# Altium schematic sheet USBtoUART.SchDoc
size A4; SheetNumber: 9; SheetTotal: 13
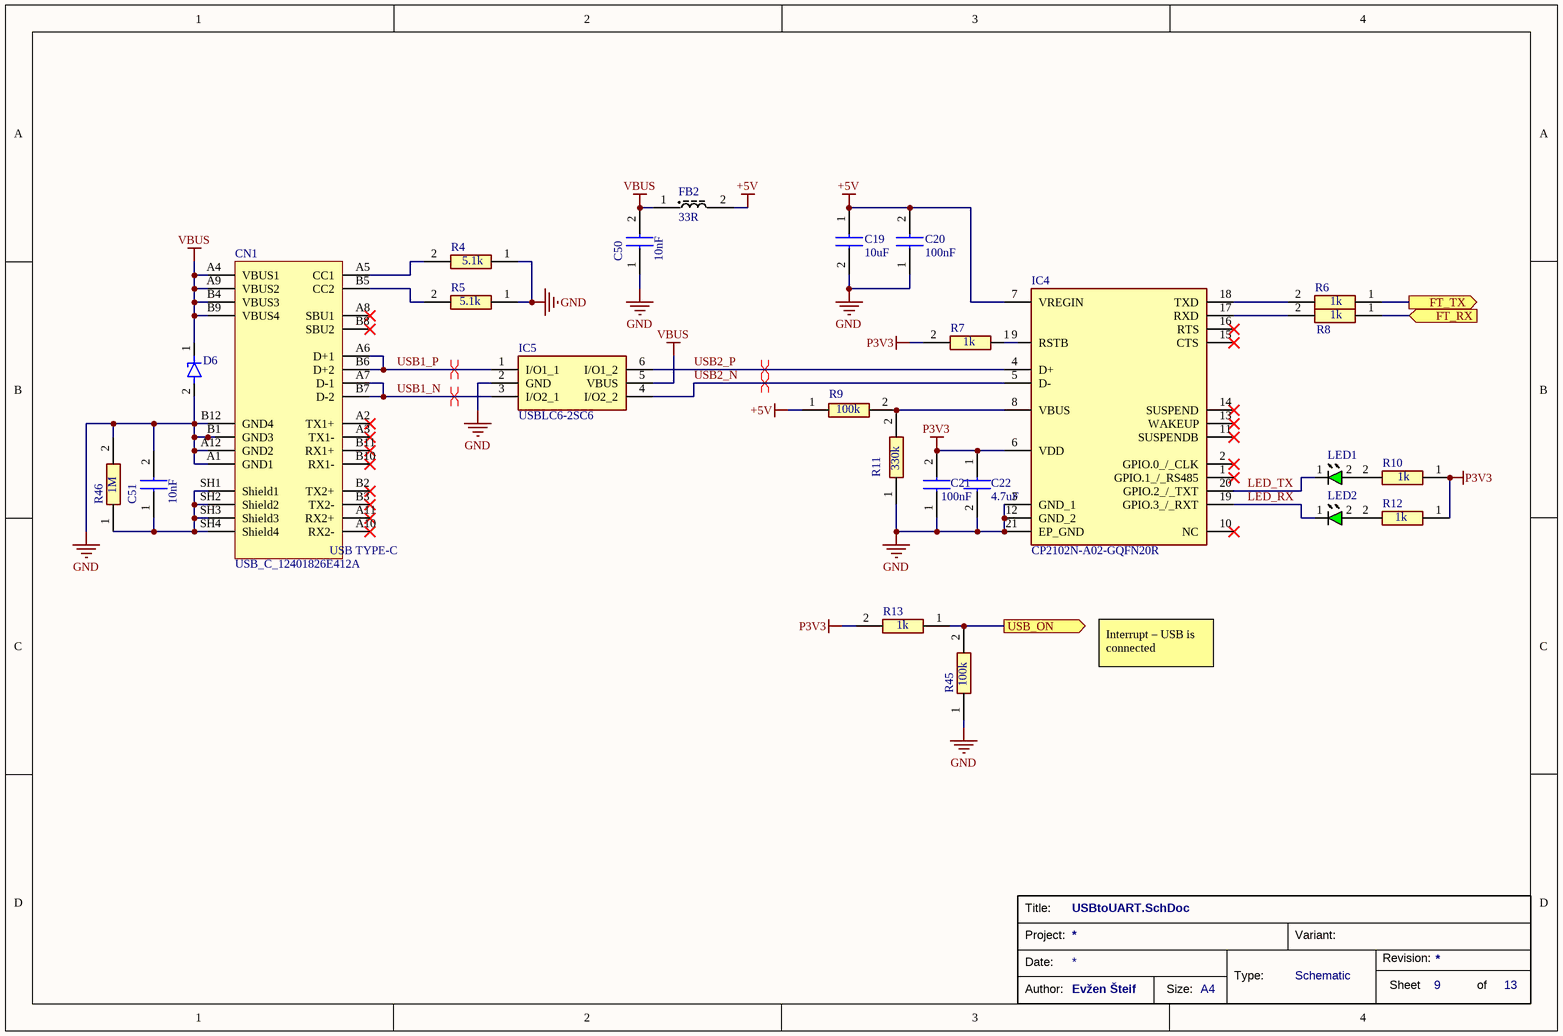
[diagram p0: USBtoUART.SchDoc]

## Parts
C19  10uF  [GRM18x]
C20  100nF  [CAPC1005X70N]
C21  100nF  [CAPC1005X70N]
C22  4.7uF  [CAPC1608X90N]
C50  10nF  [GRM15x]
C51  10nF  [GRM15x]
CN1  value USB_C_12401826E412A  [CON_USB-TYPEC_AMPHENOL_12401826E412A]  (hidden comment: USB_TYPE_C_Receptacle)
D6  ESDA25P35-1U1M  [ESDA25P351U1M]  (value not drawn)
FB2  33R  [BLM18SP221SN1B]
IC4  CP2102N-A02-GQFN20R  [CP2102NA02GQFN20]
IC5  USBLC6-2SC6  [SOT95P280X145-6N]
LED1  150060GS75000  [LEDC1608X80N]  (value not drawn)
LED2  150060GS75000  [LEDC1608X80N]  (value not drawn)
R4  5.1k  [RESC1005X35N]
R5  5.1k  [RESC1005X35N]
R6  1k  [RESC1005X35N]
R7  1k  [RESC1005X35N]
R8  1k  [RESC1005X35N]
R9  100k  [RESC1005X40N]
R10  1k  [RESC1005X35N]
R11  330k  [RESC1005X40N]
R12  1k  [RESC1005X35N]
R13  1k  [RESC1005X35N]
R45  100k  [RESC1005X40N]
R46  1M  [RESC1005X40N]

## Ports
FT_RX (in, see main[3C]), FT_TX (out, see main[3C]), USB_ON (out, see main[3C], MCU[1B])

## Nets
+5V: C19.1 C20.2 FB2.2 IC4.7(VREGIN) R9.1
GND: C19.2 C20.1 C21.1 C22.2 C50.1 C51.2 CN1.A1(GND1) CN1.A12(GND2) CN1.B1(GND3) CN1.B12(GND4) D6.2(A) IC4.3(GND_1) IC4.12(GND_2) IC4.21(EP_GND) IC5.2(GND) R4.1 R5.1 R11.1 R45.1 R46.2
P3V3: C21.2 C22.1 IC4.6(VDD) R7.2 R10.1 R12.1 R13.2
VBUS: C50.2 CN1.A4(VBUS1) CN1.A9(VBUS2) CN1.B4(VBUS3) CN1.B9(VBUS4) D6.1(K) FB2.1 IC5.5(VBUS)
FT_RX: R8.1 ; port FT_RX
FT_TX: R6.1 ; port FT_TX
LED_RX: IC4.19(GPIO.3_/_RXT) LED2.1(K)
LED_TX: IC4.20(GPIO.2_/_TXT) LED1.1(K)
USB1_N: CN1.A7(D-1) CN1.B7(D-2) IC5.3(I/O2_1)
USB1_P: CN1.A6(D+1) CN1.B6(D+2) IC5.1(I/O1_1)
USB2_N: IC4.5(D-) IC5.4(I/O2_2)
USB2_P: IC4.4(D+) IC5.6(I/O1_2)
USB_ON: R13.1 R45.2 ; port USB_ON
NetC51_1: C51.1 CN1.SH1(Shield1) CN1.SH2(Shield2) CN1.SH3(Shield3) CN1.SH4(Shield4) R46.1
NetCN1_A5: CN1.A5(CC1) R4.2
NetCN1_B5: CN1.B5(CC2) R5.2
NetIC4_8: IC4.8(VBUS) R9.2 R11.2
NetIC4_9: IC4.9(RSTB) R7.1
NetIC4_17: IC4.17(RXD) R8.2
NetIC4_18: IC4.18(TXD) R6.2
NetLED1_2: LED1.2(A) R10.2
NetLED2_2: LED2.2(A) R12.2

Not connected (* = marked no-connect by the designer): CN1 A2(TX1+)* A3(TX1-)* A8(SBU1)* A10(RX2-)* A11(RX2+)* B2(TX2+)* B3(TX2-)* B8(SBU2)* B10(RX1-)* B11(RX1+)*; IC4 1(GPIO.1_/_RS485)* 2(GPIO.0_/_CLK)* 10(NC)* 11(SUSPENDB)* 13(WAKEUP)* 14(SUSPEND)* 15(CTS)* 16(RTS)*

## Layout directives
differential pair; differential pair class USB; net class USB: USB1_N, USB1_P, USB2_N, USB2_P

## Notes on the sheet
- Interrupt – USB is connected
- Title:
- Date:
- Project:
- Type:
- Schematic
- Variant:
- Revision:
- Sheet
- of
- Author:
- Evžen Šteif
- Size:
- A4
- (in symbol MCD-03232) USB TYPE-C

## Library data of the parts
C19 = GRM188R61E106KA73D: Capacitor; Manufacturer_Name: Murata Electronics; Datasheet Link: https://search.murata.co.jp/Ceramy/image/img/A01X/G101/ENG/GRM188R61E106KA73-01A.pdf; Height: 0.9mm; Manufacturer_Part_Number: GRM188R61E106KA73D; Mouser Part Number: 81-GRM188R61E106KA3D; Mouser Price/Stock: https://www.mouser.co.uk/ProductDetail/Murata-Electronics/GRM188R61E106KA73D?qs=5aG0NVq1C4z8ebxPkQZf9A%3D%3D; Arrow Part Number: GRM188R61E106KA73D; Arrow Price/Stock: https://www.arrow.com/en/products/grm188r61e106ka73d/murata-manufacturing?region=nac
C20 C21 = GRM155R61A104KA01D: Capacitor; Manufacturer_Name: Murata Electronics; Datasheet Link: https://search.murata.co.jp/Ceramy/image/img/A01X/G101/ENG/GRM155R61A104KA01-02A.pdf; Height: 0.7mm; Manufacturer_Part_Number: GRM155R61A104KA01D; Mouser Part Number: 81-GRM155R61A104KA01; Mouser Price/Stock: https://www.mouser.co.uk/ProductDetail/Murata-Electronics/GRM155R61A104KA01D?qs=5bAuhL3RhmNZw0v59AqOJA%3D%3D; Arrow Part Number: GRM155R61A104KA01D; Arrow Price/Stock: https://www.arrow.com/en/products/grm155r61a104ka01d/murata-manufacturing?utm_currency=USD&region=europe
C22 = GRM188R61E475KE11J: Capacitor; Manufacturer_Name: Murata Electronics; Datasheet Link: https://search.murata.co.jp/Ceramy/image/img/A01X/G101/ENG/GRM188R61E475KE11-01A.pdf; Height: 0.9mm; Manufacturer_Part_Number: GRM188R61E475KE11J; Mouser Part Number: 81-GRM188R61E475KE1J; Mouser Price/Stock: https://www.mouser.co.uk/ProductDetail/Murata-Electronics/GRM188R61E475KE11J?qs=hNud%2FORuBR3%2Fa9GLJFT8KA%3D%3D; Arrow Part Number: GRM188R61E475KE11J; Arrow Price/Stock: https://www.arrow.com/en/products/grm188r61e475ke11j/murata-manufacturing
C50 C51 = GRM155R71H103KA88D: Capacitor; Manufacturer_Name: Murata Electronics; Datasheet Link: https://search.murata.co.jp/Ceramy/image/img/A01X/G101/ENG/GRM155R71H103KA88-01A.pdf; Height: 0.33mm; Manufacturer_Part_Number: GRM155R71H103KA88D; Mouser Part Number: 81-GRM155R71H103KA8D; Mouser Price/Stock: https://www.mouser.co.uk/ProductDetail/Murata-Electronics/GRM155R71H103KA88D?qs=Dfh4SrgScWxOVlCuzd3ZyQ%3D%3D; Arrow Part Number: GRM155R71H103KA88D; Arrow Price/Stock: https://www.arrow.com/en/products/grm155r71h103ka88d/murata-manufacturing?utm_currency=USD&region=nac
CN1 = MCD-03232: USB_TypeC, 24 pins, RA, SMD, T=2.96mm (USB Certified 3.1); Part_Type: Connector; Part_Preference: Recommended; Manufacturer: AMPHENOL ICC; Manufacturer_Part_Number: 12401826E412A; Component_Country_Of_Origin: China°; ShowFields: YES; ID: 5348; Internal_Part_Number: MCD-03232; Status: Checked; ComponentLink1URL: http://tunmcdsvn.tun.st.com/Component_Documentation_Library/Trunk/Connector/AMPHEMOL_ICC_12401826E412A; Order_Code_Digikey: 12401826E412ATR-ND; Order_Code_Farnell: 3727763; Order_Code_RS: N/A
D6 = ESDA25P35-1U1M: TVS Diode (Uni-directional); Manufacturer_Name: STMicroelectronics; Datasheet Link: https://www.st.com/resource/en/datasheet/esda25p35-1u1m.pdf; Height: 0.6mm; Manufacturer_Part_Number: ESDA25P35-1U1M; Mouser Part Number: 511-ESDA25P35-1U1M; Mouser Price/Stock: https://www.mouser.co.uk/ProductDetail/STMicroelectronics/ESDA25P35-1U1M?qs=aVyJF2WnouQUWqgNP85ZrA%3D%3D; Arrow Part Number: ESDA25P35-1U1M; Arrow Price/Stock: https://www.arrow.com/en/products/esda25p35-1u1m/stmicroelectronics?utm_currency=USD&region=europe
FB2 = BLM18SG330SN1D: Ferrite Bead; Manufacturer_Name: Murata Electronics; Datasheet Link: http://www.murata.com/~/media/webrenewal/support/library/catalog/products/emc/emifil/c31e.ashx?la=en-gb; Height: 0.95mm; Manufacturer_Part_Number: BLM18SG330SN1D; Mouser Part Number: 81-BLM18SG330SN1D; Mouser Price/Stock: https://www.mouser.co.uk/ProductDetail/Murata-Electronics/BLM18SG330SN1D?qs=7EBvPakHacUT88safgvlfQ%3D%3D; Arrow Part Number: BLM18SG330SN1D; Arrow Price/Stock: https://www.arrow.com/en/products/blm18sg330sn1d/murata-manufacturing
IC4 = CP2102N-A02-GQFN20R: Integrated Circuit; Manufacturer_Name: Silicon Labs; Datasheet Link: https://www.silabs.com/documents/public/data-sheets/cp2102n-datasheet.pdf; Height: 0.8mm; Manufacturer_Part_Number: CP2102N-A02-GQFN20R; Mouser Part Number: 634-CP2102NA02QFN20R; Mouser Price/Stock: https://www.mouser.co.uk/ProductDetail/Silicon-Labs/CP2102N-A02-GQFN20R?qs=u16ybLDytRbf2uwPkMBdUg%3D%3D; Arrow Part Number: CP2102N-A02-GQFN20R; Arrow Price/Stock: https://www.arrow.com/en/products/cp2102n-a02-gqfn20r/silicon-labs?utm_currency=USD&region=nac
IC5 = USBLC6-2SC6: Integrated Circuit; Manufacturer_Name: STMicroelectronics; Datasheet Link: http://www.st.com/st-web-ui/static/active/en/resource/technical/document/datasheet/CD00050750.pdf; Height: 1.45mm; Manufacturer_Part_Number: USBLC6-2SC6; Mouser Part Number: 511-USBLC6-2SC6; Mouser Price/Stock: https://www.mouser.co.uk/ProductDetail/STMicroelectronics/USBLC6-2SC6?qs=po45yt2pPpu%2FhNIlwQdTlg%3D%3D; Arrow Part Number: USBLC6-2SC6; Arrow Price/Stock: https://www.arrow.com/en/products/usblc6-2sc6/stmicroelectronics?utm_currency=USD&region=europe
LED1 LED2 = 150060GS75000: LED; Manufacturer_Name: Wurth Elektronik; Datasheet Link: https://componentsearchengine.com/Datasheets/2/150060GS75000.pdf; Height: 0.8mm; Manufacturer_Part_Number: 150060GS75000; Mouser Part Number: 710-150060GS75000; Mouser Price/Stock: https://www.mouser.co.uk/ProductDetail/Wurth-Elektronik/150060GS75000?qs=LlUlMxKIyB0UYkq5lDO8nA%3D%3D
R4 R5 = RT0402FRE075K1L: Resistor; Manufacturer_Name: YAGEO; Datasheet Link: https://www.yageo.com/upload/media/product/app/datasheet/rchip/pyu-rt_1-to-0.01_rohs_l.pdf; Height: 0.35mm; Manufacturer_Part_Number: RT0402FRE075K1L; Mouser Part Number: RT0402FRE075K1L; Mouser Price/Stock: https://www.mouser.co.uk/ProductDetail/YAGEO/RT0402FRE07100RL?qs=BXCcY9r%252B08AcvLZjF7vcwQ%3D%3D
R6-R8 R10 R12 R13 = RT0402FRE071KL: Resistor; Manufacturer_Name: KEMET; Datasheet Link: https://www.yageo.com/upload/media/product/productsearch/datasheet/rchip/PYu-RT_1-to-0.01_RoHS_L_11.pdf; Height: 0.35mm; Manufacturer_Part_Number: RT0402FRE071KL; Mouser Part Number: RT0402FRE071KL; Mouser Price/Stock: https://www.mouser.co.uk/ProductDetail/YAGEO/RT0402FRE07100KL?qs=BXCcY9r%252B08CxTvf5JB1kiw%3D%3D; Arrow Part Number: RT0402FRE07100KL; Arrow Price/Stock: https://www.arrow.com/en/products/rt0402fre07100kl/yageo
R9 R45 = RC0402BR-07100KL: Resistor; Manufacturer_Name: YAGEO; Datasheet Link: https://cz.mouser.com/datasheet/2/447/PYu_RC_Group_51_RoHS_L_12-3368608.pdf; Height: 0.4mm; Manufacturer_Part_Number: RC0402BR-07100KL
R11 = RC0402BR-07330KL: Resistor; Manufacturer_Name: YAGEO; Datasheet Link: https://cz.mouser.com/datasheet/2/447/PYu_RC_Group_51_RoHS_L_11-1984063.pdf; Height: 0.4mm; Manufacturer_Part_Number: RC0402BR-07330KL
R46 = RC0402FR-071ML: Resistor; Manufacturer_Name: YAGEO; Datasheet Link: https://componentsearchengine.com/Datasheets/2/RC0402FR-071ML.pdf; Height: 0.4mm; Manufacturer_Part_Number: RC0402FR-071ML; Mouser Part Number: 603-RC0402FR-071ML; Mouser Price/Stock: https://www.mouser.co.uk/ProductDetail/YAGEO/RC0402FR-071ML?qs=V1yeUXFNrknfoI4987wfBQ%3D%3D; Arrow Part Number: RC0402FR-071ML; Arrow Price/Stock: https://www.arrow.com/en/products/rc0402fr-071ml/yageo?region=nac